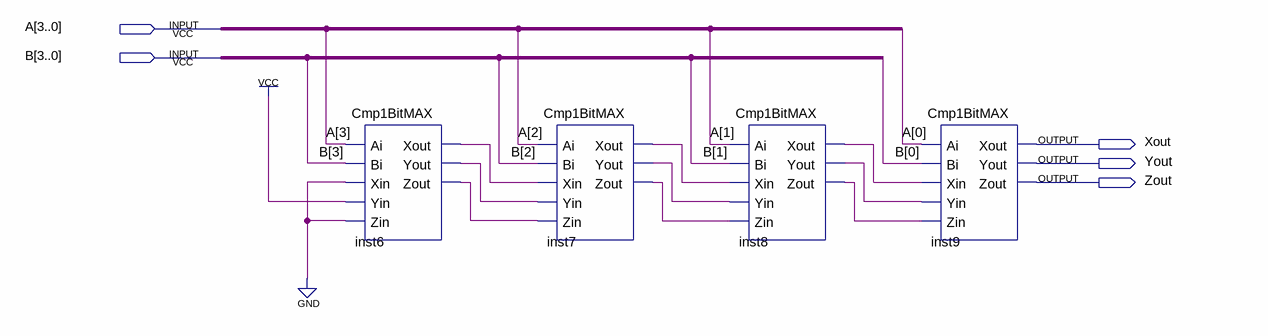
[diagram p0: schematic sheet]
// Quartus schematic Cmp4BitMAX.bdf as structural Verilog: 4 symbols, 5 pins
module Cmp4BitMAX (
  input  [3:0] A,
  input  [3:0] B,
  output Xout,
  output Yout,
  output Zout
);

  wire inst6_xout, inst6_yout, inst6_zout, inst7_xout, inst7_yout, inst7_zout, inst8_xout, inst8_yout,
       inst8_zout;

  Cmp1BitMAX inst6 (
    .Ai(A[3]), .Bi(B[3]), .Xin(1'b0), .Yin(1'b1), .Zin(1'b0), .Xout(inst6_xout), .Yout(inst6_yout),
    .Zout(inst6_zout));
  Cmp1BitMAX inst7 (
    .Ai(A[2]), .Bi(B[2]), .Xin(inst6_xout), .Yin(inst6_yout), .Zin(inst6_zout), .Xout(inst7_xout),
    .Yout(inst7_yout), .Zout(inst7_zout));
  Cmp1BitMAX inst8 (
    .Ai(A[1]), .Bi(B[1]), .Xin(inst7_xout), .Yin(inst7_yout), .Zin(inst7_zout), .Xout(inst8_xout),
    .Yout(inst8_yout), .Zout(inst8_zout));
  Cmp1BitMAX inst9 (
    .Ai(A[0]), .Bi(B[0]), .Xin(inst8_xout), .Yin(inst8_yout), .Zin(inst8_zout), .Xout(Xout), .Yout(Yout),
    .Zout(Zout));
endmodule
